# Altium schematic sheet DataDriven_sheet2_nRF9160.SchDoc
size A3; SheetNumber: 2; SheetTotal: 4; SPICEModelCacheANXREYXH: <root> / <DocumentId>ANXREYXH</DocumentId> / </root>
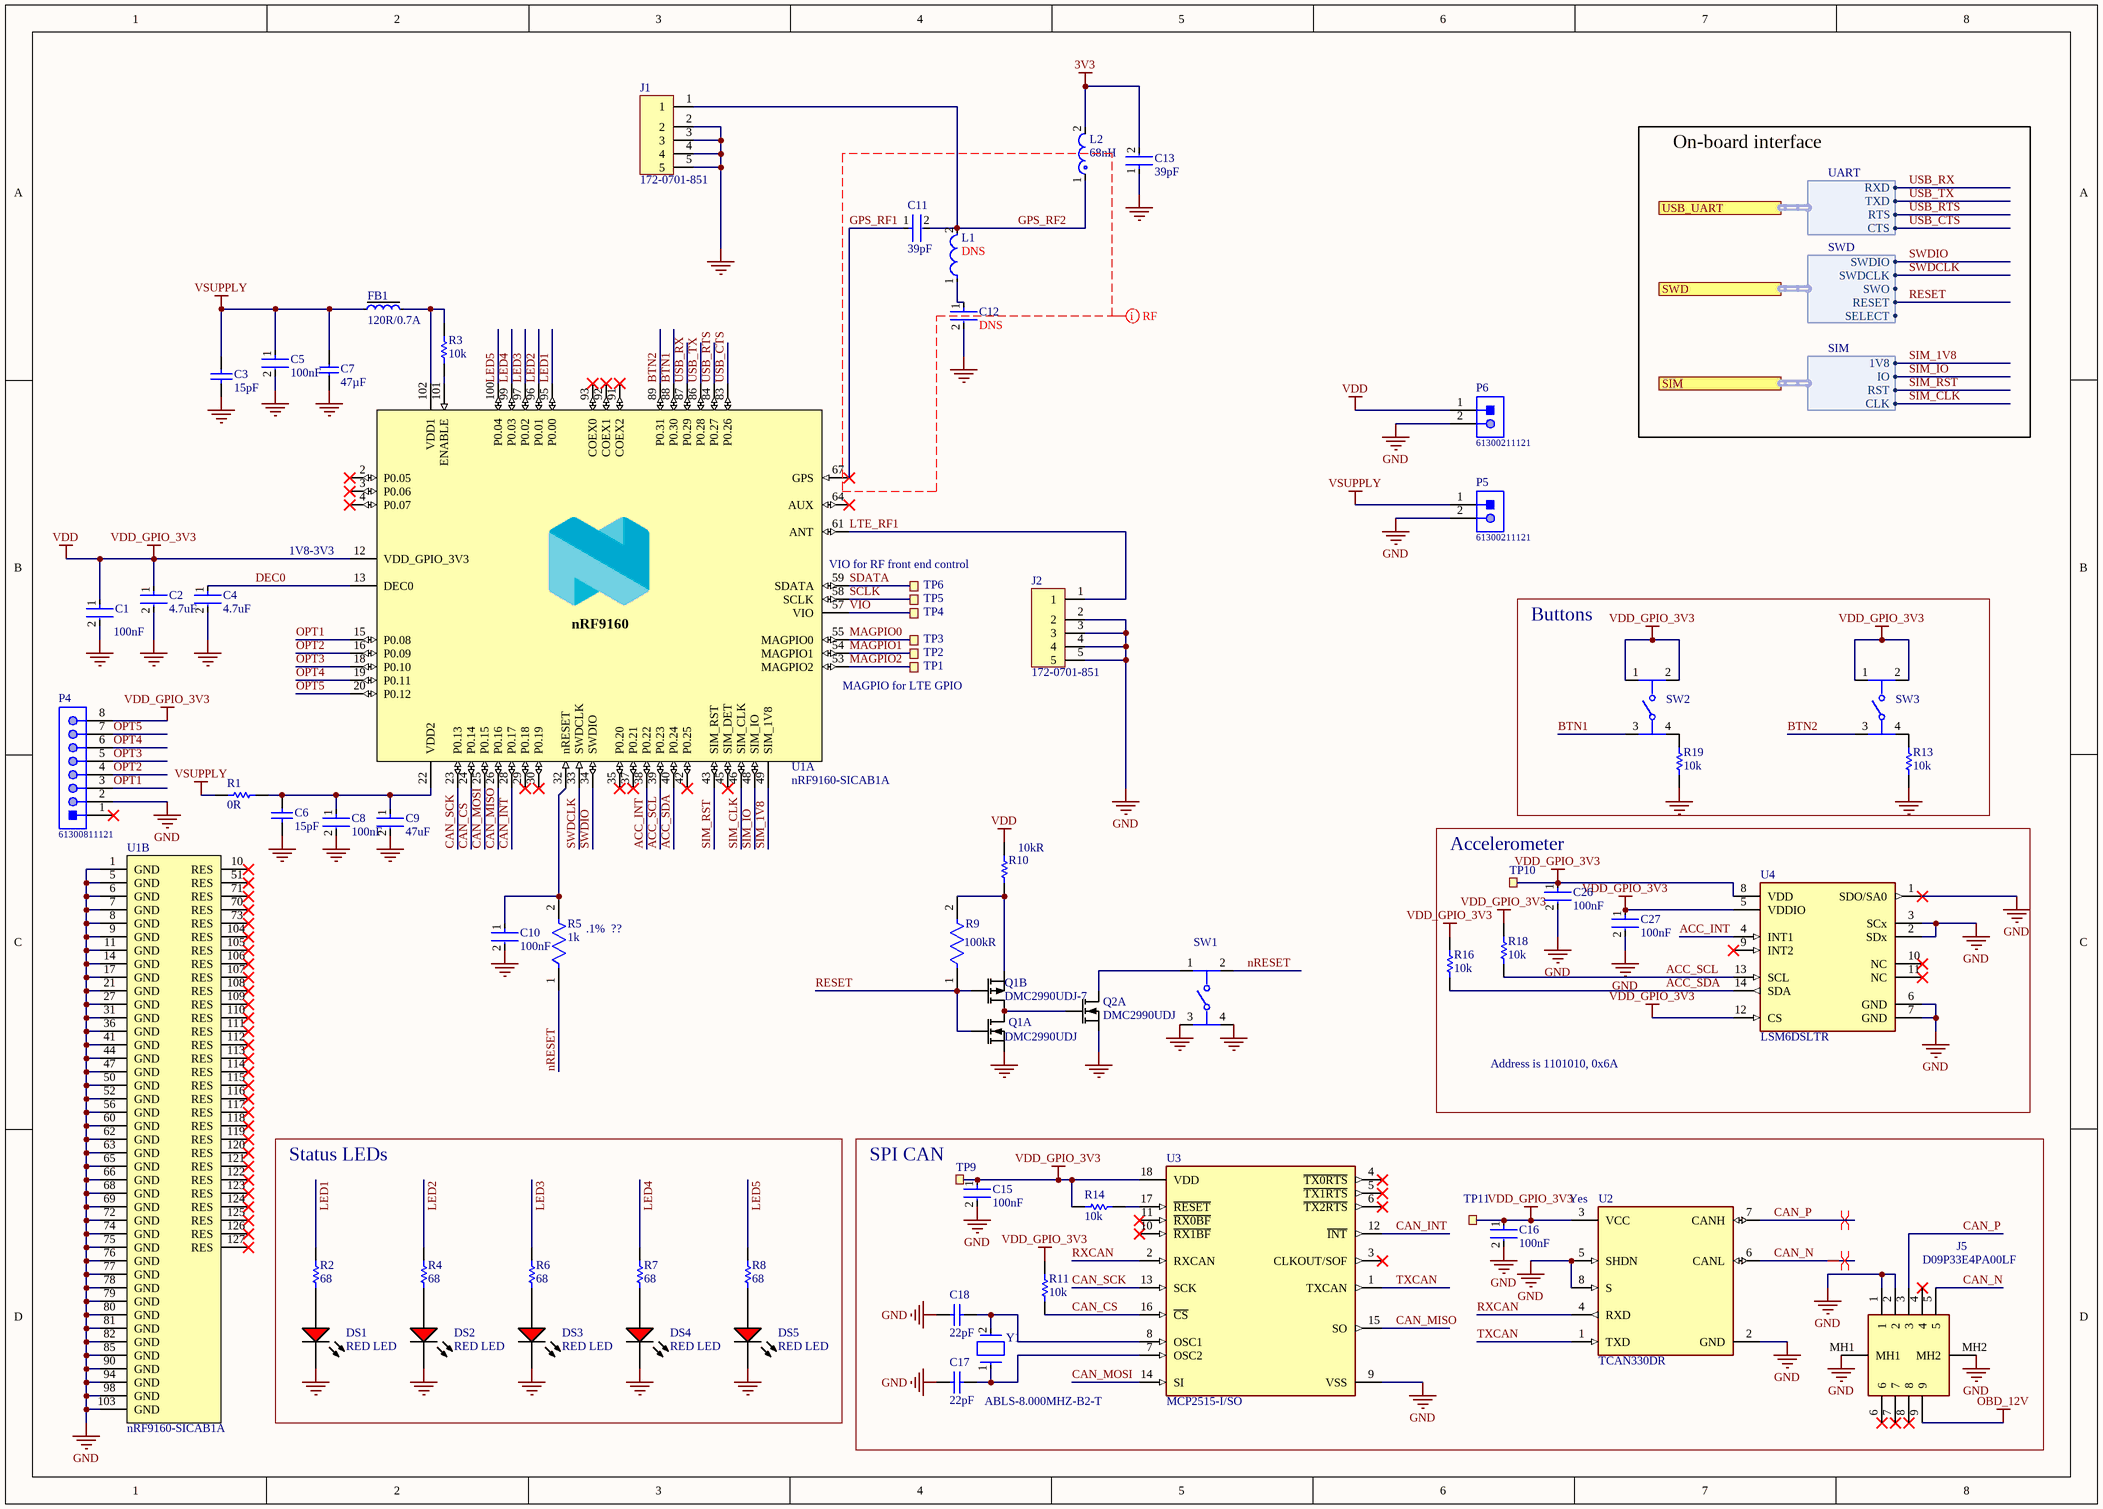
[diagram p0: DataDriven_sheet2_nRF9160.SchDoc]

## Parts
C1  100nF  [FP-CGA3E-0_3-0_1-IPC_A]
C2  4.7uF  [FP-C0603-CG-MFG]
C3  15pF  [CAPC1608X90X35ML10T15]
C4  4.7uF  [FP-C0603-CG-MFG]
C5  100nF  [FP-CGA3E-0_3-0_1-IPC_A]
C6  15pF  [CAPC1608X90X35ML10T15]
C7  47µF  [CAPC2012X11L]
C8  100nF  [FP-CGA3E-0_3-0_1-IPC_A]
C9  47uF  [FP-GRM188-0_2-IPC_B]
C10  100nF  [FP-CGA3E-0_3-0_1-IPC_A]
C11  39pF  [FP-C0603C-CF-MFG]
C12  DNS  [FP-CGA3E-0_3-0_1-IPC_A]
C13  39pF  [FP-C0603C-CF-MFG]
C15  100nF  [FP-CGA3E-0_3-0_1-IPC_A]
C16  100nF  [FP-CGA3E-0_3-0_1-IPC_A]
C17  22pF  [CAPC1608X90X35ML10T15]
C18  22pF  [CAPC1608X90X35ML10T15]
C26  100nF  [FP-CGA3E-0_3-0_1-IPC_A]
C27  100nF  [FP-CGA3E-0_3-0_1-IPC_A]
DS1  RED LED  [VISH-TLMX1100_V]
DS2  RED LED  [VISH-TLMX1100_V]
DS3  RED LED  [VISH-TLMX1100_V]
DS4  RED LED  [VISH-TLMX1100_V]
DS5  RED LED  [VISH-TLMX1100_V]
FB1  120R/0.7A  [INDC1005X04L]
J1  172-0701-851  [142-0701-851]
J2  172-0701-851  [142-0701-851]
J5  D09P33E4PA00LF  [D09P33E4PA00LF]
L1  DNS  [FP-LQW18AN_00-MFG]
L2  68nH  [FP-LQG18HH_00-MFG]
P4  61300811121  [61300811121]
P5  61300211121  [61300211121]
P6  61300211121  [61300211121]
Q1  DMC2990UDJ  [SOTFL35P100X50-6N]  (parts A,B of 2)
Q2  DMC2990UDJ  [SOTFL35P100X50-6N]  (part A of 2)
R1  0R  [RESC1608X55X25ML10T15]
R2  68  [RESC1608X55X30ML15T15]
R3  10k  [RESC1609X50X30NL8T20]
R4  68  [RESC1608X55X30ML15T15]
R5  1k  [FP-ERA3A-IPC_C]
R6  68  [RESC1608X55X30ML15T15]
R7  68  [RESC1608X55X30ML15T15]
R8  68  [RESC1608X55X30ML15T15]
R9  Resistance: 100kR  [FP-RC0603-0_55-MFG]  (hidden comment: RC0603FR-07100KL)
R10  value 10kR  [RESC1609X50X30NL8T20]  (hidden comment: 10k)
R11  10k  [RESC1609X50X30NL8T20]
R13  10k  [RESC1609X50X30NL8T20]
R14  10k  [RESC1609X50X30NL8T20]
R16  10k  [RESC1609X50X30NL8T20]
R18  10k  [RESC1609X50X30NL8T20]
R19  10k  [RESC1609X50X30NL8T20]
SW1  (no value)  [FP-PTS645SM43SMTR92LFS-MFG]
SW2  (no value)  [FP-PTS645SM43SMTR92LFS-MFG]
SW3  (no value)  [FP-PTS645SM43SMTR92LFS-MFG]
TP1  Ø1.0mm,SMD  [TP_SMD_D1.0mm]  (value not drawn)  (no BOM)
TP2  Ø1.0mm,SMD  [TP_SMD_D1.0mm]  (value not drawn)  (no BOM)
TP3  Ø1.0mm,SMD  [TP_SMD_D1.0mm]  (value not drawn)  (no BOM)
TP4  Ø1.0mm,SMD  [TP_SMD_D1.0mm]  (value not drawn)  (no BOM)
TP5  Ø1.0mm,SMD  [TP_SMD_D1.0mm]  (value not drawn)  (no BOM)
TP6  Ø1.0mm,SMD  [TP_SMD_D1.0mm]  (value not drawn)  (no BOM)
TP9  Ø1.0mm,SMD  [TP_SMD_D1.0mm]  (value not drawn)  (no BOM)
TP10  Ø1.0mm,SMD  [TP_SMD_D1.0mm]  (value not drawn)  (no BOM)
TP11  Ø1.0mm,SMD  [TP_SMD_D1.0mm]  (value not drawn)  (no BOM)
U1  nRF9160-SICAB1A  [LGA50P1600X1050X104-161N]  (parts A,B of 2)
U2  TCAN330DR  RoHS Compliant: Yes  [FP-D0008A-IPC_B]
U3  MCP2515-I/SO  [FP-C04-051-MFG]
U4  LSM6DSLTR  [FP-LGA-14L-DM00249496-MFG]
Y1  ABLS-8.000MHZ-B2-T  [FP-ABLS-MFG]

## Blocks framed on the sheet
Buttons: R13 R19 SW2 SW3
Accelerometer: C26 C27 R16 R18 TP10 U4
Status LEDs: DS1-DS5 R2 R4 R6-R8
SPI CAN: C15-C18 J5 R11 R14 TP9 TP11 U2 U3 Y1

## Ports
SIM (harness SIM, see DataDriven_sheet1_connections[3B], DataDriven_sheet4_sim_connectors[1A]), SWD (harness SWD, see DataDriven_sheet1_connections[3B], DataDriven_sheet4_sim_connectors[2B]), USB_UART (harness UART, see DataDriven_sheet1_connections[3B], DataDriven_sheet4_sim_connectors[7B])

## Harnesses
UART: RTS, CTS, RXD, TXD
SIM: CLK, IO, 1V8, RST
SWD: SWDIO, SWDCLK, SWO, RESET, SELECT

## Nets
3V3: C13.2 L2.2
GND: C1.2 C2.2 C3.1 C4.2 C5.2 C6.1 C7.2 C8.2 C9.2 C10.2 C12.2 C13.1 C15.2 C16.2 C17.1 C18.1 C26.2 C27.2 DS1.2(K) DS2.2(K) DS3.2(K) DS4.2(K) DS5.2(K) J1.2 J1.3 J1.4 J1.5 J2.2 J2.3 J2.4 J2.5 J5.1 J5.2 J5.MH1 J5.MH2 P4.2 P5.2 P6.2 Q1.1(S1) Q2.1(S1) R13.2 R19.2 SW1.3 SW1.4 U1.1(GND) U1.5(GND) U1.6(GND) U1.7(GND) U1.8(GND) U1.9(GND) U1.11(GND) U1.14(GND) U1.17(GND) U1.21(GND) U1.27(GND) U1.31(GND) U1.36(GND) U1.41(GND) U1.44(GND) U1.47(GND) U1.50(GND) U1.52(GND) U1.56(GND) U1.60(GND) U1.62(GND) U1.63(GND) U1.65(GND) U1.66(GND) U1.68(GND) U1.69(GND) U1.72(GND) U1.74(GND) U1.75(GND) U1.76(GND) U1.77(GND) U1.78(GND) U1.79(GND) U1.80(GND) U1.81(GND) U1.82(GND) U1.85(GND) U1.90(GND) U1.94(GND) U1.98(GND) U1.103(GND) U2.2(GND) U2.5(SHDN) U2.8(S) U3.9(VSS) U4.1(SDO/SA0) U4.2(SDx) U4.3(SCx) U4.6(GND) U4.7(GND)
OBD_12V: J5.9
VDD: C1.1 C2.1 C15.1 C16.1 C26.1 C27.1 P4.8 P6.1 R10.2 R11.1 R14.2 R16.2 R18.2 SW2.1 SW2.2 SW3.1 SW3.2 TP9.1 TP10.1 TP11.1 U1.12(VDD_GPIO_3V3) U2.3(VCC) U3.18(VDD) U4.5(VDDIO) U4.8(VDD) U4.12(CS)  [also labelled VDD_GPIO_3V3]
VSUPPLY: C3.2 C5.1 C7.1 FB1.1 P5.1 R1.1
ACC_INT: U1.38(P0.22) U4.4(INT1)
ACC_SCL: R18.1 U1.39(P0.23) U4.13(SCL)
ACC_SDA: R16.1 U1.40(P0.24) U4.14(SDA)
BTN1: SW2.3 U1.88(P0.30)
BTN2: SW3.3 U1.89(P0.31)
CAN_CS: R11.2 U1.24(P0.14) U3.16(~{CS})
CAN_INT: U1.28(P0.17) U3.12(~{INT})
CAN_MISO: U1.26(P0.16) U3.15(SO)
CAN_MOSI: U1.25(P0.15) U3.14(SI)
CAN_N: J5.5 U2.6(CANL)
CAN_P: J5.3 U2.7(CANH)
CAN_SCK: U1.23(P0.13) U3.13(SCK)
DEC0: C4.1 U1.13(DEC0)
GPS_RF1: C11.1 U1.67(GPS)
GPS_RF2: C11.2 J1.1 L1.2 L2.1
LED1: R2.2 U1.95(P0.00)
LED2: R4.2 U1.96(P0.01)
LED3: R6.2 U1.97(P0.02)
LED4: R7.2 U1.99(P0.03)
LED5: R8.2 U1.100(P0.04)
LTE_RF1: J2.1 U1.61(ANT)
MAGPIO0: TP3.1 U1.55(MAGPIO0)
MAGPIO1: TP2.1 U1.54(MAGPIO1)
MAGPIO2: TP1.1 U1.53(MAGPIO2)
nRESET: R5.1 SW1.2
OPT1: P4.3 U1.15(P0.08)
OPT2: P4.4 U1.16(P0.09)
OPT3: P4.5 U1.18(P0.10)
OPT4: P4.6 U1.19(P0.11)
OPT5: P4.7 U1.20(P0.12)
RESET: Q1.2(G1) Q1.5(G2) R9.1 ; port SWD.RESET
RXCAN: U2.4(RXD) U3.2(RXCAN)
SCLK: TP5.1 U1.58(SCLK)
SDATA: TP6.1 U1.59(SDATA)
SIM_1V8: U1.49(SIM_1V8) ; port SIM.1V8
SIM_CLK: U1.46(SIM_CLK) ; port SIM.CLK
SIM_IO: U1.48(SIM_IO) ; port SIM.IO
SIM_RST: U1.43(SIM_RST) ; port SIM.RST
SWDCLK: U1.33(SWDCLK) ; port SWD.SWDCLK
SWDIO: U1.34(SWDIO) ; port SWD.SWDIO
TXCAN: U2.1(TXD) U3.1(TXCAN)
USB_CTS: U1.83(P0.26) ; port USB_UART.CTS
USB_RTS: U1.84(P0.27) ; port USB_UART.RTS
USB_RX: U1.87(P0.29) ; port USB_UART.RXD
USB_TX: U1.86(P0.28) ; port USB_UART.TXD
VIO: TP4.1 U1.57(VIO)
NetC6_2: C6.2 C8.1 C9.1 R1.2 U1.22(VDD2)
NetC10_1: C10.1 R5.2 U1.32(nRESET)
NetC12_1: C12.1 L1.1
NetC17_2: C17.2 U3.7(OSC2) Y1.1
NetC18_2: C18.2 U3.8(OSC1) Y1.2
NetDS1_1: DS1.1(A) R2.1
NetDS2_1: DS2.1(A) R4.1
NetDS3_1: DS3.1(A) R6.1
NetDS4_1: DS4.1(A) R7.1
NetDS5_1: DS5.1(A) R8.1
NetFB1_2: FB1.2 R3.2 U1.102(VDD1)
NetQ1_3: Q1.3(D2) Q1.6(D1) Q2.2(G1)
NetQ1_4: Q1.4(S2) R9.2 R10.1
NetQ2_6: Q2.6(D1) SW1.1
NetR3_1: R3.1 U1.101(ENABLE)
NetR13_1: R13.1 SW3.4
NetR14_1: R14.1 U3.17(~{RESET})
NetR19_1: R19.1 SW2.4

Not connected (* = marked no-connect by the designer): J5 4* 6* 7* 8*; P4 1*; U1 2(P0.05)* 3(P0.06)* 4(P0.07)* 10(RES)* 29(P0.18)* 30(P0.19)* 35(P0.20)* 37(P0.21)* 42(P0.25)* 45(SIM_DET)* 51(RES)* 64(AUX)* 70(RES)* 71(RES)* 73(RES)* 91(COEX2)* 92(COEX1)* 93(COEX0)* 104(RES)* 105(RES)* 106(RES)* 107(RES)* 108(RES)* 109(RES)* 110(RES)* 111(RES)* 112(RES)* 113(RES)* 114(RES)* 115(RES)* 116(RES)* 117(RES)* 118(RES)* 119(RES)* 120(RES)* 121(RES)* 122(RES)* 123(RES)* 124(RES)* 125(RES)* 126(RES)* 127(RES)*; U3 3(CLKOUT/SOF)* 4(~{TX0RTS})* 5(~{TX1RTS})* 6(~{TX2RTS})* 10(~{RX1BF})* 11(~{RX0BF})*; U4 9(INT2)* 10(NC)* 11(NC)*

## Layout directives
differential pair: CAN_N, CAN_P
net class RF: GPS_RF1, GPS_RF2

## Notes on the sheet
- On-board interface
- (near U1) 1V8-3V3
- VIO for RF front end control
- MAGPIO for LTE GPIO
- (near R5) .1%  ??
- Address is 1101010, 0x6A
- (in symbol nRF9160-SICAB1A, part A) nRF9160

## Library data of the parts
C1 C5 C8 C10 C15 C16 C26 C27 = CMP-2000-07546-2: Cap Ceramic 100nF 50V X7R 10% Pad SMD 0603 +125°C Automotive T/R; Part Number: CGA3E2X7R1H104K080AA; Manufacturer: TDK Corporation; Weight: 7.1E-05oz; Composition: Ceramic; Max Operating Temperature: 125°C; Termination: SMD/SMT; Dielectric: X7R; Length: 1.6mm; Package Quantity: 1; REACH SVHC: No SVHC; Lead Free: Lead Free; Case Code (Metric): 1608; Min Operating Temperature: -55°C; Packaging: Tape and Reel; Tolerance: 10%; Voltage Rating: 50V; Case Code (Imperial): 0603; Capacitance: 100nF; Case/Package: 0603; Voltage Rating (DC): 50V; Depth: 0.8mm; Radiation Hardening: No; Ratings: AEC-Q200; Mount: Surface Mount; Voltage: 50V; Thickness: 0.035inch; Width: 0.8mm; Height: 0.8mm; Manufacturer Part Number: CGA3E2X7R1H104K080AA
C2 C4 = CMP-2006-02256-2: CAP CER 4.7UF 6.3V X5R 0603; Manufacturer: Kemet; Manufacturer Part Number: C0603C475K9PACTU; Temperature Coefficient: 15%; Tolerance: 10%; Material: Ceramic; Device Class L3: Ceramic Capacitors; RoHS: TRUE; Value: 4.7uF; Lead Free: Yes; ComponentLink2Description: Datasheet; Mouser Description: Multilayer Ceramic Capacitors MLCC - SMD/SMT 6.3volts 4.7uF X5R 10%; Package: C0603-CG; Digikey Description: CAP CER 4.7UF 6.3V X5R 0603; ComponentLink2URL: https://content.kemet.com/datasheets/KEM_C1006_X5R_SMD.pdf; Category: Cap; Temperature Range Low: -55°C; Capacitance: 4.7uF; Temperature: -55°C to +85°C; Octopart: https://octopart.com/c0603c475k9pactu-kemet-104242; Ipc Land Pattern Name: CAPC16080X80; Voltage Rating: 6.3V; Temperature Range High: +85°C; Height: 0.9mm; Temperature Characteristic: X5R; Device Class L1: Passive Components; Automotive: No; Device Class L2: Capacitors; Part Number: C0603C475K9PACTU
C3 C6 = CMP-2006-02610-1: 15 pF ±5% 50V Ceramic Capacitor C0G, NP0 0603 (1608 Metric); Part Number: GRM1885C1H150JA01D; Manufacturer: Murata; Manufacturer Part Number: GRM1885C1H150JA01D
C7 = C0805-47µ-10V: CAP CER 47UF 10V X5R 0805; Manufacturer: Murata; Manufacturer Part Number: GRM21BR61A476ME15; Part number IPS: 00000004759; Artikkelnr Noca: N.A.; Pad Count: 2; Part Number: C0805-47µ-10V; ComponentLink1URL: https://search.murata.co.jp/Ceramy/image/img/A01X/G101/ENG/GRM21BR61A476ME15-01A.pdf; ComponentLink1Description: Datasheet; ComponentLink2URL: N.A.; ComponentLink2Description: Supplier link; HelpURL: https://www.murata.com/en-global/products/productdetail?partno=GRM21BR61A476ME15%23; Footprint Doc: 0805; LatestRevisionDate: 2020-10-23; Published: 2020-08-14; Value: 47µF; Note: 10V; Supplier 1: Digi-Key; Supplier Part Number 1: 490-9961-1-ND; Supplier 2: N.A.; Supplier Part Number 2: N.A.; PartId: 100200288; Component Class: Capacitors; Author: rsk; Part number Norautron: N.A.
C9 = CMP-2000-05444-2: Chip Multilayer Ceramic Capacitors for General Purpose, 0603, 47uF, X5R, 15%, 20%, 6.3V; Part Number: GRM188R60J476ME15D; Manufacturer: Murata; Voltage Rating (DC): 6.3V; Thickness: 0.039inch; Case Code (Imperial): 0603; Packaging: Tape and Reel; Capacitance: 47uF; Width: 0.031inch; Dielectric: X5R; Max Operating Temperature: 85°C; Mount: Surface Mount; Case Code (Metric): 1608; Length: 0.063inch; Voltage Rating: 6.3V; Tolerance: 20%; Case/Package: 0603; Min Operating Temperature: -55°C; Manufacturer Part Number: GRM188R60J476ME15D
C11 C13 = CMP-2006-03315-2: CAP CER 39PF 50V 5% NP0 0603; Manufacturer Part Number: C0603C390J5GACTU; Manufacturer: KEMET; Material: Ceramic; Temperature Characteristic: C0G; Automotive Grade: Grade 1; Temperature Coefficient: 30ppm/°C; Tolerance: 0.05; Mouser Description: Cap Ceramic 39pF 50V C0G 5% SMD 1.6 x 0.8 mm 125 C Paper T/R; RoHS: TRUE; Octopart: https://octopart.com/c0603c390j5gactu-kemet-8375739; Digikey Description: CAP CER 39PF 50V 5% NP0 0603; ComponentLink2Description: Datasheet; Temperature Range Low: -55°C; Automotive: Yes; Device Class L1: Passive Components; Temperature Range High: +125°C; Package: C0603C-CF; Category: Cap; Capacitance: 39 pF; Device Class L3: Ceramic Capacitors; ComponentLink2URL: https://api.kemet.com/component-edge/download/datasheet/C0603C100J5GACAUTO.pdf; Temperature: -55°C to +125°C; Voltage Rating: 50 V; Value: 39 pF; Lead Free: Yes; Height: 0.87mm; Device Class L2: Capacitors; Part Number: C0603C390J5GACTU
C12 = CMP-2000-07546-2: Cap Ceramic 100nF 50V X7R 10% Pad SMD 0603 +125°C Automotive T/R; Weight: 7.1E-05oz; Composition: Ceramic; Max Operating Temperature: 125°C; Termination: SMD/SMT; Dielectric: X7R; Length: 1.6mm; Package Quantity: 1; REACH SVHC: No SVHC; Lead Free: Lead Free; Case Code (Metric): 1608; Min Operating Temperature: -55°C; Packaging: Tape and Reel; Tolerance: 10%; Voltage Rating: 50V; Case Code (Imperial): 0603; Capacitance: 100nF; Case/Package: 0603; Voltage Rating (DC): 50V; Depth: 0.8mm; Radiation Hardening: No; Ratings: AEC-Q200; Mount: Surface Mount; Voltage: 50V; Thickness: 0.035inch; Width: 0.8mm; Height: 0.8mm; Part Number: DNS; Manufacturer Part Number: DNS
C17 C18 = CMP-2000-04945-1: Chip Capacitor, 22 pF, +/- 5%, 50 V, -55 to 125 degC, 0603 (1608 Metric), RoHS, Tape and Reel; Manufacturer: Murata; Manufacturer Part Number: GRM1885C1H220JA01D; Rated Voltage: 50V; Dielectric: C0G; Capacitance: 22pF; Manufacturer URL: http://www.murata.com/; Datasheet Version: Jul-06; Package Reference: 603; Tolerance (%): ±5%; Case Size/Dimension: 0603; Package Description: 2-Pin Surface Mount Device, Body 1.6 x 0.8 mm; Datasheet URL: https://datasheet.ciiva.com/11786/0900766b807a1cab-11786398.pdf; Part Number: GRM1885C1H220JA01D
DS1 = CMP-1666-00027-1: LED, RED, 2.1 V, -40 to 100 degC, 2-Pin SMD (0603), RoHS, Tape and Reel; Part Number: TLMS1100-GS08; Manufacturer: Vishay; Type (Capacitors): C0G; Resistance: 100000000000 Ohm; Capacitance: 12 pF; Voltage Rating: 50 V; Tolerance: 5%; Min Operating Temperature: -55degC; REACH SVHC: No SVHC; ComponentLink2Description: Datasheet; ComponentLink1URL: http://www.vishay.com/; Width: 0.8 mm; Package Quantity: 4000; PackageReference: TLMX1100; ComponentLink2URL: http://www.vishay.com/docs/83173/tlmb1100.pdf; Case/Package: 0603; Case Code (Metric): 1608; Packaging: Tape and Reel; Pins: 2; ComponentLink1Description: Manufacturer URL; Max Operating Temperature: 125degC; Height: 0.8 mm; Length: 1.6 mm; Mount: Surface Mount; PackageDescription: 2-Pin Surface Mount Device, Body 1.6 x 0.8 mm; DatasheetVersion: Rev. 2.7, 03/2016; Case Code (Imperial): 0603; Voltage Rating (DC): 50 V; RoHSCompliant: True; Radiation Hardening: No; Manufacturer Part Number: TLMS1100-GS08
DS2-DS5 = CMP-1666-00027-1: LED, RED, 2.1 V, -40 to 100 degC, 2-Pin SMD (0603), RoHS, Tape and Reel; Manufacturer: Vishay; Manufacturer Part Number: TLMS1100-GS08; Type (Capacitors): C0G; Resistance: 100000000000 Ohm; Capacitance: 12 pF; Voltage Rating: 50 V; Tolerance: 5%; Min Operating Temperature: -55degC; REACH SVHC: No SVHC; ComponentLink2Description: Datasheet; ComponentLink1URL: http://www.vishay.com/; Width: 0.8 mm; Package Quantity: 4000; PackageReference: TLMX1100; ComponentLink2URL: http://www.vishay.com/docs/83173/tlmb1100.pdf; Case/Package: 0603; Case Code (Metric): 1608; Packaging: Tape and Reel; Pins: 2; ComponentLink1Description: Manufacturer URL; Max Operating Temperature: 125degC; Height: 0.8 mm; Length: 1.6 mm; Mount: Surface Mount; PackageDescription: 2-Pin Surface Mount Device, Body 1.6 x 0.8 mm; DatasheetVersion: Rev. 2.7, 03/2016; Case Code (Imperial): 0603; Voltage Rating (DC): 50 V; RoHSCompliant: True; Radiation Hardening: No; Part Number: TLMS1100-GS08
FB1 = FB0402-120R@100M-700mA: Ferrite Bead, 120 Ohm @ 100MHz, 700mA, 130 mOhm Max; Manufacturer: Murata; Manufacturer Part Number: BLM15AX121SN1; Part number IPS: 00000004487; Note: N.A.; Pad Count: 2; Part Number: FB0402-120R@100M-700mA; ComponentLink1URL: https://www.murata.com/en-us/products/productdata/8796740059166/ENFA0018.pdf; ComponentLink1Description: Datasheet; ComponentLink2URL: N.A.; ComponentLink2Description: Supplier link; HelpURL: https://www.murata.com/products/productdetail?partno=BLM15AX121SN1%23; Footprint Doc: 0402; LatestRevisionDate: 2020-04-28; Published: 2020-04-28; Value: 120R/0.7A; Artikkelnr Noca: N.A.; Supplier 1: Digi-Key; Supplier Part Number 1: 490-5439-1-ND; Supplier 2: N.A.; Supplier Part Number 2: N.A.; PartId: 100300100; Component Class: Inductors; Author: rsk; Part number Norautron: N.A.
J1 J2 = 172-0701-851: SMA Connector Jack, Female Socket 50Ohm Board Edge, End Launch Solder Tab; Manufacturer: Cinch Connectivity Solutions Johnson; Manufacturer Part Number: 142-0701-851; Part Number: 142-0701-851
J5 = D09P33E4PA00LF: D-Sub Standard Connectors 9P RA PIN SOLDER SHELL SIZE E; Manufacturer_Name: Amphenol FCI; Datasheet Link: https://www.mouser.com/datasheet/2/18/amphenol_amphs14020-1-1733466.pdf; Height: 12.93mm; Manufacturer_Part_Number: D09P33E4PA00LF; Mouser Part Number: 649-D09P33E4PA00LF; Mouser Price/Stock: https://www.mouser.co.uk/ProductDetail/Amphenol-Commercial-Products/G17C0910132EU?qs=1VVaZAL47g1wqtt9KNnEiQ%3D%3D; Manufacturer: Amphenol FCI; Manufacturer Part Number: D09P33E4PA00LF; Part Number: D09P33E4PA00LF
L1 = CMP-06042-014327-1: Wire Wound RF Inductor 9.1nH ±0.5nH 650mA 0.11Ω 0603 (1608); Manufacturer: Murata; Part Number: EMPCB.SMAFSTJ.B.HT; Self Resonant Frequency: 6GHz; DC Resistance (DCR): 110mR; Core Material: Non-Magnetic; Test Frequency: 100MHz; Current: 140mA; Shielding: Unshielded; Tolerance: 5%; Q Factor: 35; Case/Package: 0603; Current Rating: 650mA; Termination: SMD/SMT; Width: 0.031inch; Weight: 0.000106oz; Case Code (Metric): 1608; Series Resistance: 110mR; Packaging: Tape and Reel; Resistor Type: Wirewound; Min Operating Temperature: -55°C; Height: 0.8mm; Mount: Surface Mount; Radiation Hardening: No; Max Operating Temperature: 125°C; Max DC Current: 650mA; DC Current: 650mA; Inductance: 9.1nH; Package Quantity: 4000; Lead Free: Lead Free; Case Code (Imperial): 0603; Height - Seated (Max): 0.039inch; Depth: 1mm; Length: 1.6mm; Military Standard: Not; Manufacturer Part Number: DNS
L2 = CMP-06042-006563-1: Multilayer type RF Inductor 68nH ±5% 0.8Ω 400mA 0603; Manufacturer: Murata; Manufacturer Part Number: LQG18HN68NJ00D; Core Material: Air; DC Current: 300mA; Q Factor: 12; Test Frequency: 100MHz; DC Resistance (DCR): 800mR; Shielding: Unshielded; Self Resonant Frequency: 1GHz; Termination: SMD/SMT; Mount: Surface Mount; Case Code (Imperial): 0603; Height: 0.031inch; Tolerance: 5%; Inductance Tolerance: 5%; Package Quantity: 4000; Width: 0.8mm; Length: 0.063inch; Inductance: 68nH; Depth: 0.95mm; Case Code (Metric): 1608; Max DC Current: 300mA; Case/Package: 0603; Military Standard: Not; Min Operating Temperature: -55°C; REACH SVHC: No SVHC; Number of Pins: 2; Max Operating Temperature: 85°C; Lead Free: Lead Free; Current Rating: 300mA; Radiation Hardening: No; Packaging: Tape and Reel; Part Number: LQG18HN68NJ00D
P4 = CMP-1502-01076-1: THT Vertical Pin Header WR-PHD, Pitch 2.54 mm, Single Row, 8 pins; Manufacturer: Wurth Elektronik; Rated Current: 3A; Pin Number: 8; Working Voltage: 250VAC; Gender: Male; Contact Resistance: 20mOhm; Pitch: 2.54mm; Withstanding Voltage: 500VAC; Publisher: WurthElektronik; Operating Temperature: -40to105degC; Orientation: Vertical; Row Number: Single; Part Number: 61300811121; Package Reference: 61300811121; Mounting Technology: THT; Packaging: Bag; Manufacturer URL: http://www.we-online.de; Datasheet URL: https://katalog.we-online.de/em/datasheet/6130xx11121.pdf; Manufacturer Part Number: 61300811121
P5 P6 = CMP-1712-00002-4: THT Vertical Pin Header WR-PHD, Pitch 2.54 mm, Single Row, 2 pins; Manufacturer: Wurth Elektronik; Rated Current: 3A; Gender: Male; Withstanding Voltage: 500VAC; Working Voltage: 250VAC; Pitch: 2.54mm; Contact Resistance: 20mOhm; Pin Number: 2; Mounting Technology: THT; Orientation: Vertical; Operating Temperature: -40to105degC; Packaging: Bag; Publisher: WurthElektronik; Datasheet URL: https://katalog.we-online.de/em/datasheet/6130xx11121.pdf; Manufacturer URL: http://www.we-online.de; Row Number: Single; Package Reference: 61300211121; Part Number: 61300211121; Manufacturer Part Number: 61300211121
Q1 Q2 = DMC2990UDJ-7: MOSFET, Dual N and P-Channel, 20V, 450mA/310mA, 990mOhm, 350mW; Manufacturer: Diodes Incorporated; Part number IPS: 00000004489; Note: N.A.; Pad Count: 6; Part Number: DMC2990UDJ-7; Manufacturer Part Number: DMC2990UDJ-7; ComponentLink1URL: https://www.diodes.com/assets/Datasheets/DMC2990UDJ.pdf; ComponentLink1Description: Datasheet; ComponentLink2URL: N.A.; ComponentLink2Description: Supplier link; HelpURL: N.A.; Footprint Doc: SOT-963; LatestRevisionDate: 2020-04-28; Published: 2020-02-21; Value: DMC2990UDJ; Supplier 1: Digi-Key; Supplier Part Number 1: DMC2990UDJ-7DICT-ND; Supplier 2: N.A.; Supplier Part Number 2: N.A.; Artikkelnr Noca: N.A.; PartId: 101300174; Component Class: Semiconductors; Author: rsk; Part number Norautron: N.A.
R1 = CMP-2100-03667-1: Chip Resistor, 0 Ohm, +/- 5%, 0.1 W, -55 to 155 degC, 0603 (1608 Metric), RoHS, Tape and Reel; Manufacturer: Yageo; Manufacturer Part Number: RC0603JR-070RL; Temperature Coefficient: 200ppm/degreesC; Voltage Rating: 50V; Power Rating: 100mW; Resistance: 0mOhm; Width: 0.8mm; Max Operating Temperature: 155degC; Tolerance: 5%; Package Reference: 0603; Height: 0.45mm; Depth: 0.8mm; Package Description: 2-Pin Surface Mount Device, Body 1.6 x 0.8 mm; Termination: SMD/SMT; Package Quantity: 5000; Case/Package: 0603; Case Code (Imperial): 0603; Radiation Hardening: No; Number of Pins: 2; Length: 1.6mm; Lead Free: LeadFree; Voltage Rating (DC): 50V; Military Standard: Not; Datasheet URL: http://www.yageo.com/NewPortal/yageodocoutput?fileName=/pdf/R-Chip/PYu-RC_Group_51_RoHS_L_5.pdf; Manufacturer URL: http://www.yageo.com/; Packaging: TapeandReel; Case Code (Metric): 1608; Min Operating Temperature: -55degC; Composition: ThickFilm; RoHSCompliant: true; Contact Plating: Tin; Datasheet Version: Rev. 5, 10/2016; REACH SVHC: NoSVHC; Part Number: RC0603JR-070RL
R2 R4 R6-R8 = CMP-2000-00620-1: 68 Ohms ±1% 0.1W, 1/10W Chip Resistor 0603 (1608 Metric) Automotive AEC-Q200 Thick Film; Manufacturer: Panasonic; Part Number: ERJ-3EKF68R0V; Manufacturer Part Number: ERJ-3EKF68R0V
R3 R11 R13 R14 R16 R18 R19 = CMP-1666-00005-4: Chip Resistor, 10 KOhm, +/- 1%, 100 mW, -55 to 155 degC, 0603 (1608 Metric), RoHS, Tape and Reel; Manufacturer: Vishay Semiconductor; Manufacturer Part Number: CRCW060310K0FKEA; Voltage Rating: 75 V; Max Operating Temperature: 155 degC; PackageDescription: 2-Pin Surface Mount Device, Body 1.575 x 0.85 mm; ComponentLink1Description: Manufacturer URL; RoHSCompliant: true; PackageReference: 0603; REACH SVHC: Unknown; Length: 1.55 mm; DatasheetVersion: 06/2012; Packaging: Tape and Reel; Min Operating Temperature: -55 degC; Mounting Technology: Surface Mount; ComponentLink2URL: https://datasheet.ciiva.com/11809/0900766b80d98afc-11809037.pdf; Height: 0.45 mm; ComponentLink2Description: Datasheet; Package Quantity: 5000; ComponentLink1URL: http://www.vishay.com/; Part Number: CRCW060310K0FKEA
R5 = CMP-2000-00873-2: RES SMD 1K OHM 0.1% 1/10W 0603; Manufacturer: Panasonic; Manufacturer Part Number: ERA-3AEB102V; Temperature Coefficient: 25ppm/°C; Voltage Rating: 75V; Max Power Dissipation: 100mW; Resistance: 1kR; Technology: METAL FILM; Number of Pins: 2; Packaging: Tape and Reel; Case Code (Imperial): 0603; Case Code (Metric): 1608; Min Operating Temperature: -55°C; REACH SVHC: No SVHC; Length: 1.6mm; Termination: SMD/SMT; Depth: 0.8mm; Resistance Tolerance: 0.1%; Number of Terminations: 2; Width: 0.8mm; Military Standard: Not; Tolerance: 0.1%; Package Quantity: 5000; Contact Plating: Tin; Height: 0.45mm; Construction: Rectangular; Case/Package: 0603; Max Operating Temperature: 155°C; Resistor Type: Thin Film; Series: ERA-3A; Size Code: 0603; RoHS Compliant: Yes; Mount: Surface Mount; Radiation Hardening: No; Power Rating: 100mW; Part Number: ERA-3AEB102V
R9 = CMP-2100-03662-2: RES SMD 100K OHM 1% 1/10W 0603; Manufacturer: Yaego; Voltage Rating (DC): 50V; Max Power Dissipation: 100mW; Temperature Coefficient: 100ppm/°C; Working Voltage: 75V; Length: 1.6mm; Lead Free: Lead Free; Number of Terminations: 2; Packaging: Tape and Reel; Voltage Rating: 50V; Termination: SMD/SMT; Width: 0.8mm; Resistor Type: Thick Film; Resistance Tolerance: 1%; Features: Moisture Resistant; Height: 0.45mm; Construction: Rectangular; Case/Package: 0603; Military Standard: Not; Case Code (Imperial): 0603; Series: RC; Technology: THICK FILM; Depth: 0.8mm; RoHS Compliant: Yes; REACH SVHC: No SVHC; Min Operating Temperature: -55°C; Case Code (Metric): 1608; Max Operating Temperature: 155°C; Power Rating: 100mW; Number of Pins: 2; Tolerance: 1%; Manufacturer Part Number: RC0603FR-07100KL; Part Number: RC0603FR-07100KL
R10 = CMP-1666-00005-4: Chip Resistor, 10 KOhm, +/- 1%, 100 mW, -55 to 155 degC, 0603 (1608 Metric), RoHS, Tape and Reel; Manufacturer: Vishay Semiconductor; Manufacturer Part Number: CRCW060310K0FKEA; Voltage Rating: 75 V; Power Rating: 100mW; Temperature Coefficient: 100ppm/°C; Voltage Rating (DC): 75V; Max Operating Temperature: 155 degC; PackageDescription: 2-Pin Surface Mount Device, Body 1.575 x 0.85 mm; ComponentLink1Description: Manufacturer URL; RoHSCompliant: true; PackageReference: 0603; REACH SVHC: Unknown; Length: 1.55 mm; DatasheetVersion: 06/2012; Packaging: Tape and Reel; Min Operating Temperature: -55 degC; Mounting Technology: Surface Mount; ComponentLink2URL: https://datasheet.ciiva.com/11809/0900766b80d98afc-11809037.pdf; Height: 0.45 mm; ComponentLink2Description: Datasheet; Package Quantity: 5000; ComponentLink1URL: http://www.vishay.com/; Supplier 1: Newark; Supplier Part Number 1: 61M5335; Supplier 2: Future Electronics; Supplier Part Number 2: 8926099; Supplier 3: Digi-Key; Supplier Part Number 3: 541-10.0KHDKR-ND; RoHS: Yes; Category: Chip SMD Resistors; Pricing 3: 1=0.10000, 10=0.03800, 100=0.01560, 1000=0.00701, 2500=0.00608 (USD); Case/Package: 0603; Pins: 2; Contact Plating: Tin; Weight: 7.1E-05oz; Case Code (Metric): 1608; Case Code (Imperial): 0603; Tolerance: 1%; Resistor Type: Thick Film; Number of Terminations: 2; Termination: SMD/SMT; Max Power Dissipation: 100mW; Features: Automotive AEC-Q200; Series: CRCW; Construction: Rectangular; Resistance Tolerance: 1%; Technology: THICK FILM; Width: 0.033inch; Depth: 0.85mm; Radiation Hardening: No; Lead Free: Lead Free; RoHS Compliant: Yes; Military Standard: Not; ComponentLink3URL: https://datasheet.ciiva.com/11809/0900766b80d98afc-11809037.pdf?src-supplier=Rs; ComponentLink3Description: https://datasheet.ciiva.com/11809/0900766b80d98afc-11809037.pdf?src-supplier=Rs; ComponentLink4URL: https://datasheet.ciiva.com/26314/fld-crcw-e3-data-en-26314749.pdf?src-supplier=Distrelec; ComponentLink4Description: https://datasheet.ciiva.com/26314/fld-crcw-e3-data-en-26314749.pdf?src-supplier=Distrelec; ComponentLink5URL: https://datasheet.ciiva.com/46385/1697337-46385498.pdf?src-supplier=Element14; ComponentLink5Description: https://datasheet.ciiva.com/46385/1697337-46385498.pdf?src-supplier=Element14; ComponentLink6URL: https://datasheet.ciiva.com/2465/dcrcwe3-2465514.pdf?src-supplier=Digi-Key; ComponentLink6Description: https://datasheet.ciiva.com/2465/dcrcwe3-2465514.pdf?src-supplier=Digi-Key; ComponentLink7URL: https://datasheet.ciiva.com/2465/dcrcwe3-2465515.pdf?src-supplier=Digi-Key; ComponentLink7Description: https://datasheet.ciiva.com/2465/dcrcwe3-2465515.pdf?src-supplier=Digi-Key; ComponentLink8URL: https://datasheet.ciiva.com/2465/dcrcwe3-2465513.pdf?src-supplier=Digi-Key; ComponentLink8Description: https://datasheet.ciiva.com/2465/dcrcwe3-2465513.pdf?src-supplier=Digi-Key; ComponentLink9URL: https://datasheet.ciiva.com/16719/70201119-16719704.pdf?src-supplier=Allied+Electronics; ComponentLink9Description: https://datasheet.ciiva.com/16719/70201119-16719704.pdf?src-supplier=Allied+Electronics; ComponentLink10URL: https://datasheet.ciiva.com/16754/70201119-16754710.pdf?src-supplier=Allied+Electronics; ComponentLink10Description: https://datasheet.ciiva.com/16754/70201119-16754710.pdf?src-supplier=Allied+Electronics; ComponentLink11URL: https://datasheet.ciiva.com/5543/dcrcwe3-109170-5543001.pdf?src-supplier=Mouser; ComponentLink11Description: https://datasheet.ciiva.com/5543/dcrcwe3-109170-5543001.pdf?src-supplier=Mouser; ComponentLink12URL: https://datasheet.ciiva.com/3256/dcrcwe3-3256940.pdf?src-supplier=Avnet; ComponentLink12Description: https://datasheet.ciiva.com/3256/dcrcwe3-3256940.pdf?src-supplier=Avnet; ComponentLink13URL: https://datasheet.ciiva.com/16209/dcrcwe3-16209164.pdf?src-supplier=Future+Electronics; ComponentLink13Description: https://datasheet.ciiva.com/16209/dcrcwe3-16209164.pdf?src-supplier=Future+Electronics; ComponentLink14URL: https://datasheet.ciiva.com/26821/getdatasheetpartid-86831-26821109.pdf?src-supplier=Verical; ComponentLink14Description: https://datasheet.ciiva.com/26821/getdatasheetpartid-86831-26821109.pdf?src-supplier=Verical; ComponentLink15URL: https://datasheet.ciiva.com/3256/dcrcwe3-3256939.pdf?src-supplier=Avnet; ComponentLink15Description: https://datasheet.ciiva.com/3256/dcrcwe3-3256939.pdf?src-supplier=Avnet; Part Number: CRCW060310K0FKEA
SW1-SW3 = CMP-2000-05160-2: SWITCH TACTILE SPST-NO 0.05A 12V; Manufacturer: ITT C&K; Manufacturer Part Number: PTS645SM43SMTR92LFS; Contact Resistance: 100mR; Throw Configuration: SPST; Illumination Type: Non-Illuminated; Mechanical Life: 100000Cycles; Current Rating: 50mA; Switch Function: Off-Mom; Actuator Length: 0.85mm; Actuator Material: Nylon; Actuator Type: Standard; Operating Force: 160gf; Min Operating Temperature: -20°C; REACH SVHC: No SVHC; Termination: Gull Wing; Case/Package: SMD/SMT; Packaging: Tape and Reel; Mount: Surface Mount; Voltage Rating (DC): 12V; Orientation: Straight; Lead Free: Lead Free; Contact Material: Silver; Color: Black; Max Current Rating: 50mA; Contact Plating: Silver; Depth: 9mm; Package Quantity: 1; Max Voltage Rating (DC): 12V; Length: 6mm; Max Operating Temperature: 60°C; Part Number: PTS645SM43SMTR92LFS
TP1-TP6 TP9-TP11 = TP_SMD_Ø1.0MM: 1.0mm circular SMD testpad; Manufacturer: Nordic Semiconductor; Manufacturer Part Number: NRF9160-SICA-B1A-R; Note: N.A.; Pad Count: 1; Part Number: TP_SMD_Ø1.0MM; ComponentLink1URL: N.A.; ComponentLink1Description: Datasheet; ComponentLink2URL: N.A.; ComponentLink2Description: Supplier link; HelpURL: N.A.; Footprint Doc: TP_SMD_Ø1.0mm; LatestRevisionDate: 2021-03-05; Published: 2013-06-11; Value: Ø1.0mm,SMD; Artikkelnr Noca: N.A.; Part number IPS: N.A.; Supplier 1: N.A.; Supplier Part Number 1: N.A.; Supplier 2: N.A.; Supplier Part Number 2: N.A.; PartId: 100500475; Component Class: Connectors; Author: rsk; Part number Norautron: N.A.
U1 = nRF9160-SICAB1A: Low power System-in-Package with integrated LTE-M/NB-IoT modem and GPS; Manufacturer: Nordic Semiconductor; Part number IPS: 80000002329; Note: N.A.; Pad Count: 161; Part Number: nRF9160-SICAB1A; Manufacturer Part Number: nRF9160-SICAB1A; Footprint Doc: LGA-161; Value: nRF9160-SICAB1A; ComponentLink1URL: N.A.; ComponentLink1Description: Datasheet; ComponentLink2URL: N.A.; ComponentLink2Description: Supplier link; HelpURL: N.A.; LatestRevisionDate: 2020-08-13; Published: 2020-08-13; Supplier 1: Nordic Semiconductor; Supplier Part Number 1: nRF9160-SICAB1A; Supplier 2: N.A.; Supplier Part Number 2: N.A.; Artikkelnr Noca: N.A.; Component Class: nRF_Devices; Author: rsk; Part number Norautron: N.A.; PartId: 102000165
U2 = CMP-04872-000104-1: IC TRANSCEIVER 1/1 8SOIC; Manufacturer: Texas Instruments; Data Rate: 1Mbps; Case/Package: SOIC; Mount: Surface Mount; Number of Pins: 8; Packaging: Cut Tape; Max Operating Temperature: 125°C; Lead Free: Lead Free; Min Operating Temperature: -40°C; Manufacturer Part Number: TCAN330DR; Part Number: TCAN330DR
U3 = CMP-0186-00133-3: IC CAN CONTROLLER W/SPI 18SOIC; Manufacturer: Microchip; Min Supply Voltage: 2.7V; Max Supply Voltage: 5.5V; Standoff Height: 0.1mm; Nominal Supply Current: 10mA; Interface: SPI,CAN; Lead Free: Yes; Digikey Description: IC CAN CONTROLLER W/SPI 18SOIC; Category: IC; RoHS: TRUE; Manufacturer Part Number: MCP2515-I/SO; ComponentLink2URL: http://ww1.microchip.com/downloads/en/DeviceDoc/MCP2515-Stand-Alone-CAN-Controller-with-SPI-20001801J.pdf; Mouser Description: CAN Interface IC W/ SPI Interface; Device Class L2: Interface ICs; Package: C04-051; Automotive: No; Function: Controller; Octopart: https://octopart.com/mcp2515-i%2Fso-microchip-430187; Temperature: -40°C to +85°C; Ipc Land Pattern Name: SOIC127P1030X265-18; Ambient Temperature Range Low: -65°C; Height: 2.65mm; Device Class L1: Integrated Circuits (ICs); Ambient Temperature Range High: +125°C; Footprint Url: http://ww1.microchip.com/downloads/en/DeviceDoc/18L_SOIC_Wide_7.50_SO_C04-0051D.pdf; Temperature Range Low: -40°C; Device Class L3: Controllers; Temperature Range High: +85°C; ComponentLink2Description: Datasheet; Part Number: MCP2515-I/SO
U4 = CMP-2000-07467-2: IMU ACCEL/GYRO I2C/SPI 14LGA; Manufacturer: STMicroelectronics; Resolution: 16bits; Max Supply Voltage: 3.6V; Sensor Type: Temperature,Accelerometer,Gyroscope; Sensor Output: I2C,SPI; Gyro Range: 125/250/500/1000/2000°/s; Accel Range: 2/4/8/16g; Operating Supply Current: 0.29-0.65mA; Min Supply Voltage: 1.62V; Package: LGA-14L-DM00249496; Temperature Range High: +85°C; Automotive: No; Footprint Url: https://www.st.com/resource/en/technical_note/cd00134799.pdf; Height: 0.86mm; Device Class L1: Sensors; Octopart: https://octopart.com/lsm6dsltr-stmicroelectronics-66358193; Device Class L2: Motion Sensors; Lead Free: Yes; Category: IC; Device Class L3: Inertial Measurement Units (IMUs); ComponentLink2Description: Datasheet; RoHS: TRUE; ComponentLink2URL: https://www.st.com/resource/en/datasheet/lsm6dsl.pdf; Temperature Range Low: -40°C; Manufacturer Part Number: LSM6DSLTR; Mouser Description: iNEMO inertial module: always-on 3D accelerometer and 3D gyroscope; Digikey Description: IMU ACCEL/GYRO I2C/SPI 14LGA; Temperature: -40°C to +85°C; Part Number: LSM6DSLTR
Y1 = CMP-27762-009874-1: CRYSTAL 8.0000MHZ 18PF SMD; Manufacturer: Abracon LLC; ESR (Equivalent Series Resistance): 80R; Operating Frequency: 8 MHz; Frequency Stability: 50ppm; Tolerance: 20ppm; Frequency: 8MHz; Min Operating Temperature: -20°C; Lead Free: Lead Free; Width: 4.7mm; Packaging: Tape and Reel; Series: ABLS; Accuracy: 20ppm; Length: 11.4mm; Frequency Tolerance: 20ppm; Termination: SMD/SMT; Number of Pins: 2; Radiation Hardening: No; Depth: 4.7mm; REACH SVHC: No SVHC; Contact Plating: Tin; Load Capacitance: 18pF; Case/Package: SMD/SMT; Mount: Surface Mount; Package Quantity: 1000; Max Operating Temperature: 70°C; Height: 0.165inch; Series Resistance: 80R; Manufacturer Part Number: ABLS-8.000MHZ-B2-T; Part Number: ABLS-8.000MHZ-B2-T